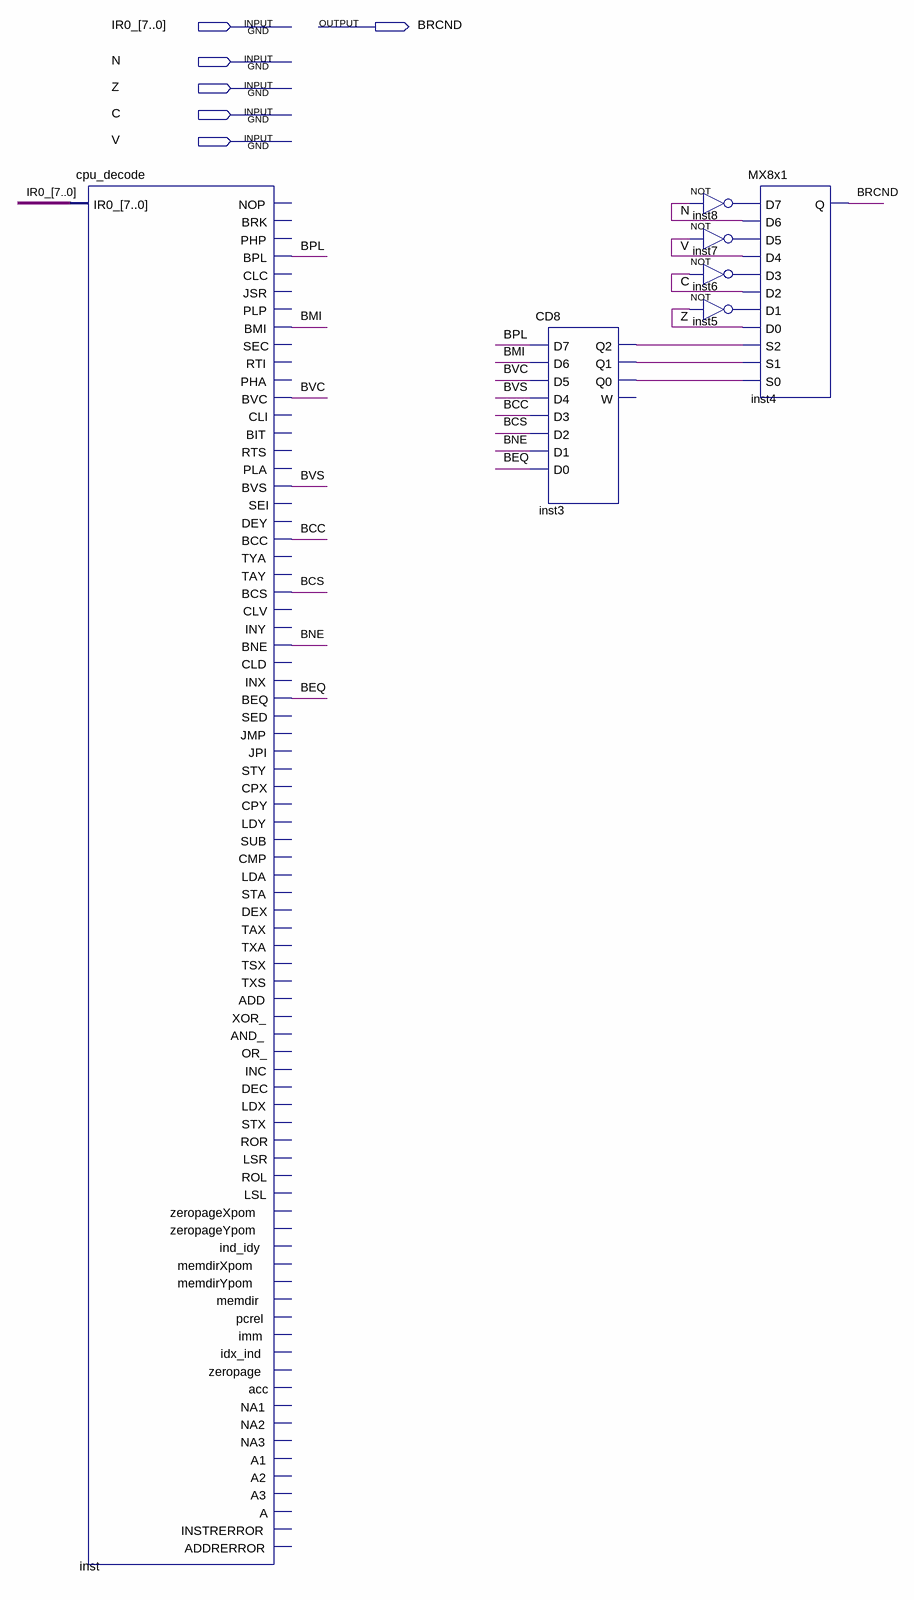
[diagram p0: schematic sheet]
// Quartus schematic cpu_branching.bdf as structural Verilog: 7 symbols, 6 pins
module cpu_branching (
  input  [7:0] IR0_,
  input  N,
  input  Z,
  input  C,
  input  V,
  output BRCND
);

  wire BCC, BCS, BEQ, BMI, BNE, BPL, BVC, BVS, inst3_q0, inst3_q1, inst3_q2, inst5_out, inst6_out, inst7_out,
       inst8_out;

  cpu_decode inst (
    .IR0_(IR0_), .BPL(BPL), .BMI(BMI), .BVC(BVC), .BVS(BVS), .BCC(BCC), .BCS(BCS), .BNE(BNE), .BEQ(BEQ));  // open: NOP, BRK, PHP, CLC, JSR, PLP, SEC, RTI, PHA, CLI, BIT, RTS, PLA, SEI, DEY, TYA, TAY, CLV, INY, CLD, INX, SED, JMP, JPI, STY, CPX, CPY, LDY, SUB, CMP, LDA, STA, DEX, TAX, TXA, TSX, TXS, ADD, XOR_, AND_, OR_, INC, DEC, LDX, STX, ROR, LSR, ROL, LSL, zeropageXpom, zeropageYpom, ind_idy, memdirXpom, memdirYpom, memdir, pcrel, imm, idx_ind, zeropage, acc, NA1, NA2, NA3, A1, A2, A3, A, INSTRERROR, ADDRERROR
  CD8 inst3 (
    .D7(BPL), .D6(BMI), .D5(BVC), .D4(BVS), .D3(BCC), .D2(BCS), .D1(BNE), .D0(BEQ), .Q2(inst3_q2),
    .Q1(inst3_q1), .Q0(inst3_q0));  // open: W
  not inst8 (inst8_out, N);
  not inst7 (inst7_out, V);
  not inst6 (inst6_out, C);
  not inst5 (inst5_out, Z);
  MX8x1 inst4 (
    .D7(inst8_out), .D6(N), .D5(inst7_out), .D4(V), .D3(inst6_out), .D2(C), .D1(inst5_out), .D0(Z),
    .S2(inst3_q2), .S1(inst3_q1), .S0(inst3_q0), .Q(BRCND));
endmodule
